# Altium project FPGA_EP4CE10F17C8N.PrjPcb
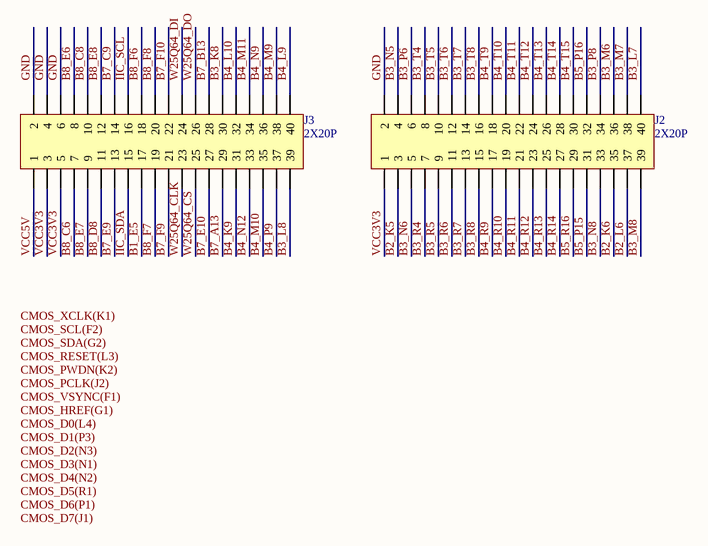
[diagram p0: 1_BTB.SchDoc]
4 sheets, 181 parts. Net scope: global (net labels, ports and power ports of the same name join across sheets).
Board file: EP4CE10F17NC8N.PcbDoc
Sheets:
  1_BTB.SchDoc
  2_FPGAIO.SchDoc
  3_SDRAM.SchDoc
  4_HDMI+ETH.SchDoc

## Sheet 1_BTB.SchDoc
size A4; SheetNumber: 1; SheetTotal: 4

### Parts
J2  2X20P  [HEAD_2X20P]
J3  2X20P  [HEAD_2X20P]

### Nets
GND: J2.2 J3.2 J3.4 J3.6
VCC3V3: J2.1 J3.3 J3.5
VCC5V: J3.1
B1_E5: J3.17
B2_K5: J2.3
B2_K6: J2.35
B2_L6: J2.37
B3_K8: J3.30
B3_L7: J2.40
B3_L8: J3.39
B3_M6: J2.36
B3_M7: J2.38
B3_M8: J2.39
B3_N5: J2.4
B3_N6: J2.5
B3_N8: J2.33
B3_P6: J2.6
B3_P8: J2.34
B3_R4: J2.7
B3_R5: J2.9
B3_R6: J2.11
B3_R7: J2.13
B3_R8: J2.15
B3_T4: J2.8
B3_T5: J2.10
B3_T6: J2.12
B3_T7: J2.14
B3_T8: J2.16
B4_K9: J3.31
B4_L9: J3.40
B4_L10: J3.32
B4_M9: J3.38
B4_M10: J3.35
B4_M11: J3.34
B4_N9: J3.36
B4_N12: J3.33
B4_P9: J3.37
B4_R9: J2.17
B4_R10: J2.19
B4_R11: J2.21
B4_R12: J2.23
B4_R13: J2.25
B4_R14: J2.27
B4_T9: J2.18
B4_T10: J2.20
B4_T11: J2.22
B4_T12: J2.24
B4_T13: J2.26
B4_T14: J2.28
B4_T15: J2.30
B5_P15: J2.31
B5_P16: J2.32
B5_R16: J2.29
B7_A13: J3.29
B7_B13: J3.28
B7_C9: J3.14
B7_E9: J3.13
B7_E10: J3.27
B7_F9: J3.21
B7_F10: J3.22
B8_C6: J3.7
B8_C8: J3.10
B8_D8: J3.11
B8_E6: J3.8
B8_E7: J3.9
B8_E8: J3.12
B8_F6: J3.18
B8_F7: J3.19
B8_F8: J3.20
IIC_SCL: J3.16
IIC_SDA: J3.15
W25Q64_CLK: J3.23
W25Q64_CS: J3.25
W25Q64_DI: J3.24
W25Q64_DO: J3.26

### Notes on the sheet
- Labels drawn without touching a wire or pin: CMOS_D0(L4), CMOS_D1(P3), CMOS_D2(N3), CMOS_D3(N1), CMOS_D4(N2), CMOS_D5(R1), CMOS_D6(P1), CMOS_D7(J1), CMOS_HREF(G1), CMOS_PCLK(J2), CMOS_PWDN(K2), CMOS_RESET(L3), CMOS_SCL(F2), CMOS_SDA(G2), CMOS_VSYNC(F1), CMOS_XCLK(K1)

## Sheet 2_FPGAIO.SchDoc
size A3; SheetNumber: 2; SheetTotal: 4
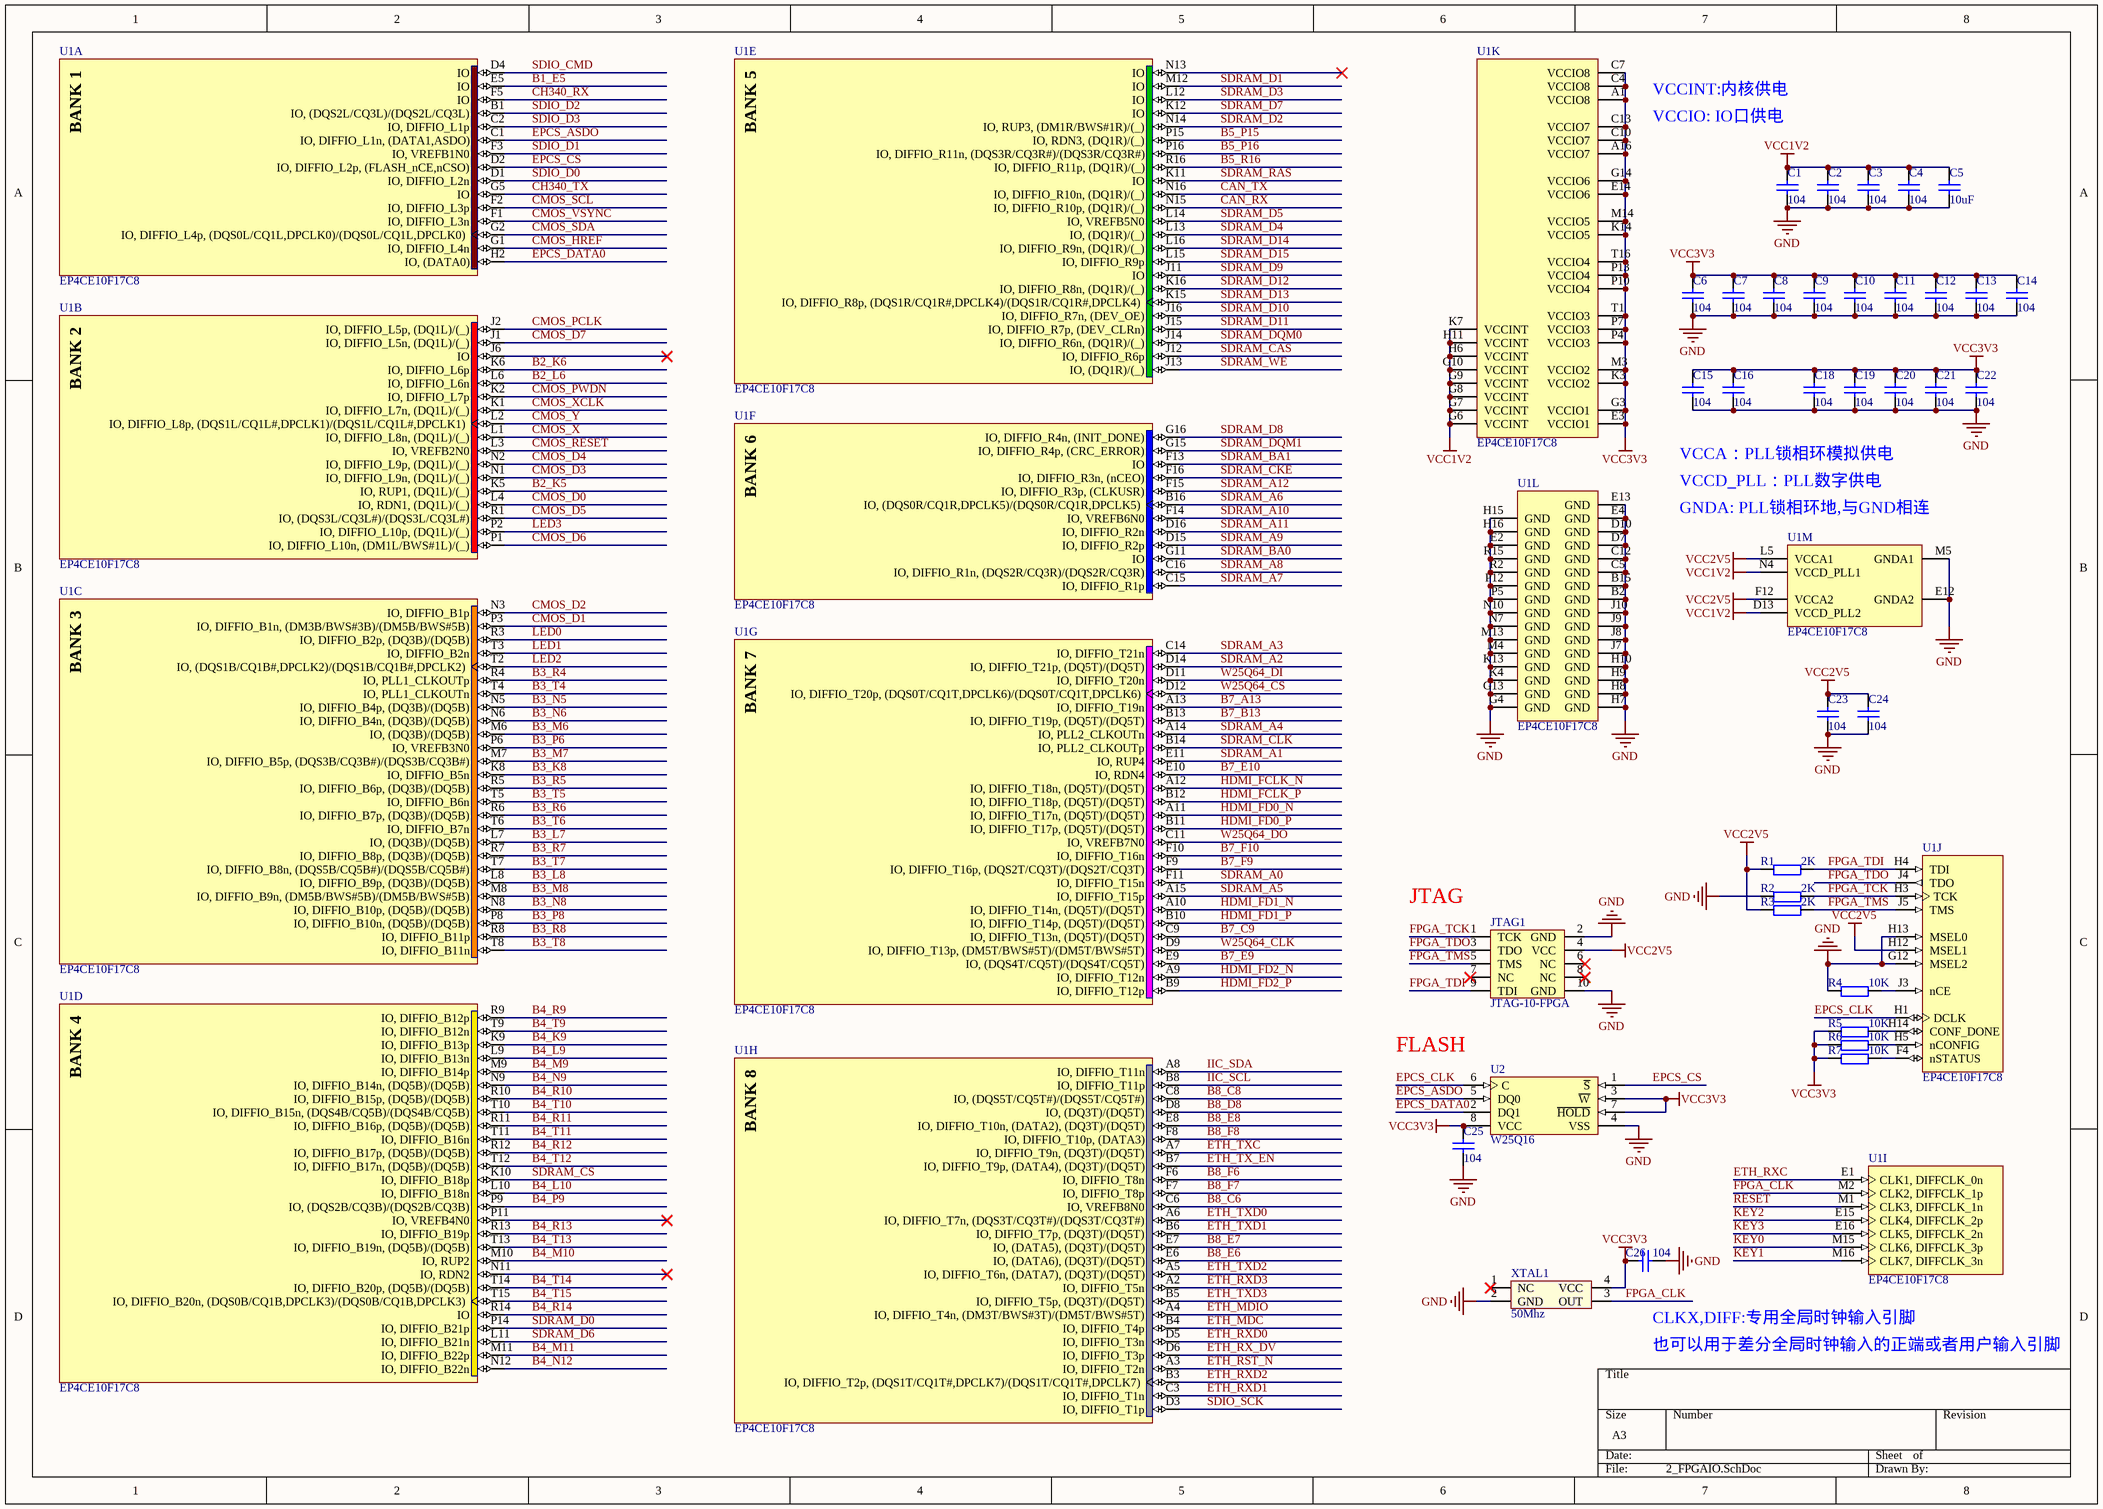
[diagram p1: 2_FPGAIO.SchDoc]

### Parts
C1  104  [C 0402]
C2  104  [C 0402]
C3  104  [C 0402]
C4  104  [C 0402]
C5  10uF  [C 0402]
C6  104  [C 0402]
C7  104  [C 0402]
C8  104  [C 0402]
C9  104  [C 0402]
C10  104  [C 0402]
C11  104  [C 0402]
C12  104  [C 0402]
C13  104  [C 0402]
C14  104  [C 0402]
C15  104  [C 0402]
C16  104  [C 0402]
C18  104  [C 0402]
C19  104  [C 0402]
C20  104  [C 0402]
C21  104  [C 0402]
C22  104  [C 0402]
C23  104  [C 0402]
C24  104  [C 0402]
C25  104  [C 0603]
C26  104  [C 0603]
JTAG1  JTAG-10-FPGA  [JTAG座_弯角_2x5]
R1  2K  [R 0402]
R2  2K  [R 0402]
R3  2K  [R 0402]
R4  10K  [R 0402]
R5  10K  [R 0402]
R6  10K  [R 0402]
R7  10K  [R 0402]
U1  EP4CE10F17C8  [FBGA256]  (parts A,B,C,D,E,F,G,H,I,J,K,L,M of 13)
U2  W25Q16  [SOIC-8_L5.3-W5.3-P1.27-LS8.0-BL]
XTAL1  50Mhz  [XTAL3225]

### Nets
GND: C1.2 C2.2 C3.2 C4.2 C5.2 C6.2 C7.2 C8.2 C9.2 C10.2 C11.2 C12.2 C13.2 C14.2 C15.2 C16.2 C18.2 C19.2 C20.2 C21.2 C22.2 C23.2 C24.2 C25.2 C26.2 JTAG1.2(GND) JTAG1.10(GND) R2.1 R4.1 U1.B2(GND) U1.B15(GND) U1.C5(GND) U1.C12(GND) U1.D7(GND) U1.D10(GND) U1.E2(GND) U1.E4(GND) U1.E12(GNDA2) U1.E13(GND) U1.G4(GND) U1.G12(MSEL2) U1.G13(GND) U1.H7(GND) U1.H8(GND) U1.H9(GND) U1.H10(GND) U1.H13(MSEL0) U1.H15(GND) U1.H16(GND) U1.J7(GND) U1.J8(GND) U1.J9(GND) U1.J10(GND) U1.K4(GND) U1.K13(GND) U1.M4(GND) U1.M5(GNDA1) U1.M13(GND) U1.N7(GND) U1.N10(GND) U1.P5(GND) U1.P12(GND) U1.R2(GND) U1.R15(GND) U2.4(VSS) XTAL1.2(GND)
VCC1V2: C1.1 C2.1 C3.1 C4.1 C5.1 U1.D13(VCCD_PLL2) U1.G6(VCCINT) U1.G7(VCCINT) U1.G8(VCCINT) U1.G9(VCCINT) U1.G10(VCCINT) U1.H6(VCCINT) U1.H11(VCCINT) U1.K7(VCCINT) U1.N4(VCCD_PLL1)
VCC2V5: C23.1 C24.1 JTAG1.4(VCC) R1.1 R3.1 U1.F12(VCCA2) U1.H12(MSEL1) U1.L5(VCCA1)
VCC3V3: C6.1 C7.1 C8.1 C9.1 C10.1 C11.1 C12.1 C13.1 C14.1 C15.1 C16.1 C18.1 C19.1 C20.1 C21.1 C22.1 C25.1 C26.1 R5.1 R6.1 R7.1 U1.A1(VCCIO8) U1.A16(VCCIO7) U1.C4(VCCIO8) U1.C7(VCCIO8) U1.C10(VCCIO7) U1.C13(VCCIO7) U1.E3(VCCIO1) U1.E14(VCCIO6) U1.G3(VCCIO1) U1.G14(VCCIO6) U1.K3(VCCIO2) U1.K14(VCCIO5) U1.M3(VCCIO2) U1.M14(VCCIO5) U1.P4(VCCIO3) U1.P7(VCCIO3) U1.P10(VCCIO4) U1.P13(VCCIO4) U1.T1(VCCIO3) U1.T16(VCCIO4) U2.3(~{W}) U2.7(~{HOLD}) U2.8(VCC) XTAL1.4(VCC)
B1_E5: U1.E5(IO)
B2_K5: U1.K5(IO,_RUP1,_(DQ1L)/(_))
B2_K6: U1.K6(IO,_DIFFIO_L6p)
B2_L6: U1.L6(IO,_DIFFIO_L6n)
B3_K8: U1.K8(IO,_DIFFIO_B5n)
B3_L7: U1.L7(IO,_(DQ3B)/(DQ5B))
B3_L8: U1.L8(IO,_DIFFIO_B9p,_(DQ3B)/(DQ5B))
B3_M6: U1.M6(IO,_(DQ3B)/(DQ5B))
B3_M7: U1.M7(IO,_DIFFIO_B5p,_(DQS3B/CQ3B#)/(DQS3B/CQ3B#))
B3_M8: U1.M8(IO,_DIFFIO_B9n,_(DM5B/BWS#5B)/(DM5B/BWS#5B))
B3_N5: U1.N5(IO,_DIFFIO_B4p,_(DQ3B)/(DQ5B))
B3_N6: U1.N6(IO,_DIFFIO_B4n,_(DQ3B)/(DQ5B))
B3_N8: U1.N8(IO,_DIFFIO_B10p,_(DQ5B)/(DQ5B))
B3_P6: U1.P6(IO,_VREFB3N0)
B3_P8: U1.P8(IO,_DIFFIO_B10n,_(DQ5B)/(DQ5B))
B3_R4: U1.R4(IO,_PLL1_CLKOUTp)
B3_R5: U1.R5(IO,_DIFFIO_B6p,_(DQ3B)/(DQ5B))
B3_R6: U1.R6(IO,_DIFFIO_B7p,_(DQ3B)/(DQ5B))
B3_R7: U1.R7(IO,_DIFFIO_B8p,_(DQ3B)/(DQ5B))
B3_R8: U1.R8(IO,_DIFFIO_B11p)
B3_T4: U1.T4(IO,_PLL1_CLKOUTn)
B3_T5: U1.T5(IO,_DIFFIO_B6n)
B3_T6: U1.T6(IO,_DIFFIO_B7n)
B3_T7: U1.T7(IO,_DIFFIO_B8n,_(DQS5B/CQ5B#)/(DQS5B/CQ5B#))
B3_T8: U1.T8(IO,_DIFFIO_B11n)
B4_K9: U1.K9(IO,_DIFFIO_B13p)
B4_L9: U1.L9(IO,_DIFFIO_B13n)
B4_L10: U1.L10(IO,_DIFFIO_B18n)
B4_M9: U1.M9(IO,_DIFFIO_B14p)
B4_M10: U1.M10(IO,_RUP2)
B4_M11: U1.M11(IO,_DIFFIO_B22p)
B4_N9: U1.N9(IO,_DIFFIO_B14n,_(DQ5B)/(DQ5B))
B4_N12: U1.N12(IO,_DIFFIO_B22n)
B4_P9: U1.P9(IO,_(DQS2B/CQ3B)/(DQS2B/CQ3B))
B4_R9: U1.R9(IO,_DIFFIO_B12p)
B4_R10: U1.R10(IO,_DIFFIO_B15p,_(DQ5B)/(DQ5B))
B4_R11: U1.R11(IO,_DIFFIO_B16p,_(DQ5B)/(DQ5B))
B4_R12: U1.R12(IO,_DIFFIO_B17p,_(DQ5B)/(DQ5B))
B4_R13: U1.R13(IO,_DIFFIO_B19p)
B4_R14: U1.R14(IO)
B4_T9: U1.T9(IO,_DIFFIO_B12n)
B4_T10: U1.T10(IO,_DIFFIO_B15n,_(DQS4B/CQ5B)/(DQS4B/CQ5B))
B4_T11: U1.T11(IO,_DIFFIO_B16n)
B4_T12: U1.T12(IO,_DIFFIO_B17n,_(DQ5B)/(DQ5B))
B4_T13: U1.T13(IO,_DIFFIO_B19n,_(DQ5B)/(DQ5B))
B4_T14: U1.T14(IO,_DIFFIO_B20p,_(DQ5B)/(DQ5B))
B4_T15: U1.T15(IO,_DIFFIO_B20n,_(DQS0B/CQ1B,DPCLK3)/(DQS0B/CQ1B,DPCLK3))
B5_P15: U1.P15(IO,_RDN3,_(DQ1R)/(_))
B5_P16: U1.P16(IO,_DIFFIO_R11n,_(DQS3R/CQ3R#)/(DQS3R/CQ3R#))
B5_R16: U1.R16(IO,_DIFFIO_R11p,_(DQ1R)/(_))
B7_A13: U1.A13(IO,_DIFFIO_T19n)
B7_B13: U1.B13(IO,_DIFFIO_T19p,_(DQ5T)/(DQ5T))
B7_C9: U1.C9(IO,_DIFFIO_T13n,_(DQ5T)/(DQ5T))
B7_E9: U1.E9(IO,_(DQS4T/CQ5T)/(DQS4T/CQ5T))
B7_E10: U1.E10(IO,_RDN4)
B7_F9: U1.F9(IO,_DIFFIO_T16p,_(DQS2T/CQ3T)/(DQS2T/CQ3T))
B7_F10: U1.F10(IO,_DIFFIO_T16n)
B8_C6: U1.C6(IO,_VREFB8N0)
B8_C8: U1.C8(IO,_(DQS5T/CQ5T#)/(DQS5T/CQ5T#))
B8_D8: U1.D8(IO,_(DQ3T)/(DQ5T))
B8_E6: U1.E6(IO,_(DATA6),_(DQ3T)/(DQ5T))
B8_E7: U1.E7(IO,_(DATA5),_(DQ3T)/(DQ5T))
B8_E8: U1.E8(IO,_DIFFIO_T10n,_(DATA2),_(DQ3T)/(DQ5T))
B8_F6: U1.F6(IO,_DIFFIO_T8n)
B8_F7: U1.F7(IO,_DIFFIO_T8p)
B8_F8: U1.F8(IO,_DIFFIO_T10p,_(DATA3))
CAN_RX: U1.N15(IO,_DIFFIO_R10p,_(DQ1R)/(_))
CAN_TX: U1.N16(IO,_DIFFIO_R10n,_(DQ1R)/(_))
CH340_RX: U1.F5(IO)
CH340_TX: U1.G5(IO)
CMOS_D0: U1.L4(IO,_RDN1,_(DQ1L)/(_))
CMOS_D1: U1.P3(IO,_DIFFIO_B1n,_(DM3B/BWS#3B)/(DM5B/BWS#5B))
CMOS_D2: U1.N3(IO,_DIFFIO_B1p)
CMOS_D3: U1.N1(IO,_DIFFIO_L9n,_(DQ1L)/(_))
CMOS_D4: U1.N2(IO,_DIFFIO_L9p,_(DQ1L)/(_))
CMOS_D5: U1.R1(IO,_(DQS3L/CQ3L#)/(DQS3L/CQ3L#))
CMOS_D6: U1.P1(IO,_DIFFIO_L10n,_(DM1L/BWS#1L)/(_))
CMOS_D7: U1.J1(IO,_DIFFIO_L5n,_(DQ1L)/(_))
CMOS_HREF: U1.G1(IO,_DIFFIO_L4n)
CMOS_PCLK: U1.J2(IO,_DIFFIO_L5p,_(DQ1L)/(_))
CMOS_PWDN: U1.K2(IO,_DIFFIO_L7p)
CMOS_RESET: U1.L3(IO,_VREFB2N0)
CMOS_SCL: U1.F2(IO,_DIFFIO_L3p)
CMOS_SDA: U1.G2(IO,_DIFFIO_L4p,_(DQS0L/CQ1L,DPCLK0)/(DQS0L/CQ1L,DPCLK0))
CMOS_VSYNC: U1.F1(IO,_DIFFIO_L3n)
CMOS_X: U1.L1(IO,_DIFFIO_L8n,_(DQ1L)/(_))
CMOS_XCLK: U1.K1(IO,_DIFFIO_L7n,_(DQ1L)/(_))
CMOS_Y: U1.L2(IO,_DIFFIO_L8p,_(DQS1L/CQ1L#,DPCLK1)/(DQS1L/CQ1L#,DPCLK1))
EPCS_ASDO: U1.C1(IO,_DIFFIO_L1n,_(DATA1,ASDO)) U2.5(DQ0)
EPCS_CLK: U1.H1(DCLK) U2.6(C)
EPCS_CS: U1.D2(IO,_DIFFIO_L2p,_(FLASH_nCE,nCSO)) U2.1(~{S})
EPCS_DATA0: U1.H2(IO,_(DATA0)) U2.2(DQ1)
ETH_MDC: U1.B4(IO,_DIFFIO_T4p)
ETH_MDIO: U1.A4(IO,_DIFFIO_T4n,_(DM3T/BWS#3T)/(DM5T/BWS#5T))
ETH_RST_N: U1.A3(IO,_DIFFIO_T2n)
ETH_RX_DV: U1.D6(IO,_DIFFIO_T3p)
ETH_RXC: U1.E1(CLK1,_DIFFCLK_0n)
ETH_RXD0: U1.D5(IO,_DIFFIO_T3n)
ETH_RXD1: U1.C3(IO,_DIFFIO_T1n)
ETH_RXD2: U1.B3(IO,_DIFFIO_T2p,_(DQS1T/CQ1T#,DPCLK7)/(DQS1T/CQ1T#,DPCLK7))
ETH_RXD3: U1.A2(IO,_DIFFIO_T5n)
ETH_TX_EN: U1.B7(IO,_DIFFIO_T9p,_(DATA4),_(DQ3T)/(DQ5T))
ETH_TXC: U1.A7(IO,_DIFFIO_T9n,_(DQ3T)/(DQ5T))
ETH_TXD0: U1.A6(IO,_DIFFIO_T7n,_(DQS3T/CQ3T#)/(DQS3T/CQ3T#))
ETH_TXD1: U1.B6(IO,_DIFFIO_T7p,_(DQ3T)/(DQ5T))
ETH_TXD2: U1.A5(IO,_DIFFIO_T6n,_(DATA7),_(DQ3T)/(DQ5T))
ETH_TXD3: U1.B5(IO,_DIFFIO_T5p,_(DQ3T)/(DQ5T))
FPGA_CLK: U1.M2(CLK2,_DIFFCLK_1p) XTAL1.3(OUT)
FPGA_TCK: JTAG1.1(TCK) R2.2 U1.H3(TCK)
FPGA_TDI: JTAG1.9(TDI) R1.2 U1.H4(TDI)
FPGA_TDO: JTAG1.3(TDO) U1.J4(TDO)
FPGA_TMS: JTAG1.5(TMS) R3.2 U1.J5(TMS)
HDMI_FCLK_N: U1.A12(IO,_DIFFIO_T18n,_(DQ5T)/(DQ5T))
HDMI_FCLK_P: U1.B12(IO,_DIFFIO_T18p,_(DQ5T)/(DQ5T))
HDMI_FD0_N: U1.A11(IO,_DIFFIO_T17n,_(DQ5T)/(DQ5T))
HDMI_FD0_P: U1.B11(IO,_DIFFIO_T17p,_(DQ5T)/(DQ5T))
HDMI_FD1_N: U1.A10(IO,_DIFFIO_T14n,_(DQ5T)/(DQ5T))
HDMI_FD1_P: U1.B10(IO,_DIFFIO_T14p,_(DQ5T)/(DQ5T))
HDMI_FD2_N: U1.A9(IO,_DIFFIO_T12n)
HDMI_FD2_P: U1.B9(IO,_DIFFIO_T12p)
IIC_SCL: U1.B8(IO,_DIFFIO_T11p)
IIC_SDA: U1.A8(IO,_DIFFIO_T11n)
KEY0: U1.M15(CLK6,_DIFFCLK_3p)
KEY1: U1.M16(CLK7,_DIFFCLK_3n)
KEY2: U1.E15(CLK4,_DIFFCLK_2p)
KEY3: U1.E16(CLK5,_DIFFCLK_2n)
LED0: U1.R3(IO,_DIFFIO_B2p,_(DQ3B)/(DQ5B))
LED1: U1.T3(IO,_DIFFIO_B2n)
LED2: U1.T2(IO,_(DQS1B/CQ1B#,DPCLK2)/(DQS1B/CQ1B#,DPCLK2))
LED3: U1.P2(IO,_DIFFIO_L10p,_(DQ1L)/(_))
RESET: U1.M1(CLK3,_DIFFCLK_1n)
SDIO_CMD: U1.D4(IO)
SDIO_D0: U1.D1(IO,_DIFFIO_L2n)
SDIO_D1: U1.F3(IO,_VREFB1N0)
SDIO_D2: U1.B1(IO,_(DQS2L/CQ3L)/(DQS2L/CQ3L))
SDIO_D3: U1.C2(IO,_DIFFIO_L1p)
SDIO_SCK: U1.D3(IO,_DIFFIO_T1p)
SDRAM_A0: U1.F11(IO,_DIFFIO_T15n)
SDRAM_A1: U1.E11(IO,_RUP4)
SDRAM_A2: U1.D14(IO,_DIFFIO_T21p,_(DQ5T)/(DQ5T))
SDRAM_A3: U1.C14(IO,_DIFFIO_T21n)
SDRAM_A4: U1.A14(IO,_PLL2_CLKOUTn)
SDRAM_A5: U1.A15(IO,_DIFFIO_T15p)
SDRAM_A6: U1.B16(IO,_(DQS0R/CQ1R,DPCLK5)/(DQS0R/CQ1R,DPCLK5))
SDRAM_A7: U1.C15(IO,_DIFFIO_R1p)
SDRAM_A8: U1.C16(IO,_DIFFIO_R1n,_(DQS2R/CQ3R)/(DQS2R/CQ3R))
SDRAM_A9: U1.D15(IO,_DIFFIO_R2p)
SDRAM_A10: U1.F14(IO,_VREFB6N0)
SDRAM_A11: U1.D16(IO,_DIFFIO_R2n)
SDRAM_A12: U1.F15(IO,_DIFFIO_R3p,_(CLKUSR))
SDRAM_BA0: U1.G11(IO)
SDRAM_BA1: U1.F13(IO)
SDRAM_CAS: U1.J12(IO,_DIFFIO_R6p)
SDRAM_CKE: U1.F16(IO,_DIFFIO_R3n,_(nCEO))
SDRAM_CLK: U1.B14(IO,_PLL2_CLKOUTp)
SDRAM_CS: U1.K10(IO,_DIFFIO_B18p)
SDRAM_D0: U1.P14(IO,_DIFFIO_B21p)
SDRAM_D1: U1.M12(IO)
SDRAM_D2: U1.N14(IO,_RUP3,_(DM1R/BWS#1R)/(_))
SDRAM_D3: U1.L12(IO)
SDRAM_D4: U1.L13(IO,_(DQ1R)/(_))
SDRAM_D5: U1.L14(IO,_VREFB5N0)
SDRAM_D6: U1.L11(IO,_DIFFIO_B21n)
SDRAM_D7: U1.K12(IO)
SDRAM_D8: U1.G16(IO,_DIFFIO_R4n,_(INIT_DONE))
SDRAM_D9: U1.J11(IO)
SDRAM_D10: U1.J16(IO,_DIFFIO_R7n,_(DEV_OE))
SDRAM_D11: U1.J15(IO,_DIFFIO_R7p,_(DEV_CLRn))
SDRAM_D12: U1.K16(IO,_DIFFIO_R8n,_(DQ1R)/(_))
SDRAM_D13: U1.K15(IO,_DIFFIO_R8p,_(DQS1R/CQ1R#,DPCLK4)/(DQS1R/CQ1R#,DPCLK4))
SDRAM_D14: U1.L16(IO,_DIFFIO_R9n,_(DQ1R)/(_))
SDRAM_D15: U1.L15(IO,_DIFFIO_R9p)
SDRAM_DQM0: U1.J14(IO,_DIFFIO_R6n,_(DQ1R)/(_))
SDRAM_DQM1: U1.G15(IO,_DIFFIO_R4p,_(CRC_ERROR))
SDRAM_RAS: U1.K11(IO)
SDRAM_WE: U1.J13(IO,_(DQ1R)/(_))
W25Q64_CLK: U1.D9(IO,_DIFFIO_T13p,_(DM5T/BWS#5T)/(DM5T/BWS#5T))
W25Q64_CS: U1.D12(IO,_DIFFIO_T20p,_(DQS0T/CQ1T,DPCLK6)/(DQS0T/CQ1T,DPCLK6))
W25Q64_DI: U1.D11(IO,_DIFFIO_T20n)
W25Q64_DO: U1.C11(IO,_VREFB7N0)
NetR4_2: R4.2 U1.J3(nCE)
NetR5_2: R5.2 U1.H14(CONF_DONE)
NetR6_2: R6.2 U1.H5(nCONFIG)
NetR7_2: R7.2 U1.F4(nSTATUS)

Not connected (* = marked no-connect by the designer): JTAG1 6(NC)* 7(NC)* 8(NC)*; U1 J6(IO)* N11(IO,_RDN2)* N13(IO)* P11(IO,_VREFB4N0)*; XTAL1 1(NC)*

### Notes on the sheet
- VCCINT:内核供电
- VCCIO: IO口供电
- (near U1) GNDA: PLL锁相环地,与GND相连
- VCCA：PLL锁相环模拟供电
- VCCD_PLL：PLL数字供电
- (near JTAG1) JTAG
- FLASH
- CLKX,DIFF:专用全局时钟输入引脚
- 也可以用于差分全局时钟输入的正端或者用户输入引脚
- (in symbol EP4CE6F17C8, part A) BANK 1
- (in symbol EP4CE6F17C8, part B) BANK 2
- (in symbol EP4CE6F17C8, part C) BANK 3
- (in symbol EP4CE6F17C8, part D) BANK 4
- (in symbol EP4CE6F17C8, part E) BANK 5
- (in symbol EP4CE6F17C8, part F) BANK 6
- (in symbol EP4CE6F17C8, part G) BANK 7
- (in symbol EP4CE6F17C8, part H) BANK 8

### Library data of the parts
C1-C16 C18-C26 = C-0603-SMD
R1-R7 = R
U1 = EP4CE6F17C8: Cyclone IV Family FPGA, 2V Core, 179 I/O Pins, 2 PLLs, 256-Pin FBGA, Speed Grade 8, Commercial Grade; Published: 3-May-2010; DatasheetVersion: ver1.2, Mar-2010; PackageVersion: ver16.0, Dec-2009; PackageReference: FBGA256; Publisher: Altium Limited; PackageDescription: 256-Ball FineLine Ball Grid Array (FBGA256) - Option 1 - Wire Bond; Supplier 1: Digi-Key; Supplier Part Number 1: EP4CE6F17C8-ND; Code_JEDEC: MS-034-AAF-1; Code_IPC: BGA100P16X16-256; ComponentLink1Description: Manufacturer Link; ComponentLink1URL: http://www.altera.com/; ComponentLink2Description: Handbook; ComponentLink2URL: http://www.altera.com/literature/hb/cyclone-iv/cyclone4-handbook.pdf; ComponentLink3Description: Pinout Specification; ComponentLink3URL: http://www.altera.com/literature/lit-dp.jsp?category=cyc%204&showspreadsheet=y; ComponentLink4Description: Packaging Specification; ComponentLink4URL: http://www.altera.com/literature/ds/dspkg.pdf
U2 = M25P16: 16 Mb (x1) Automotive Serial NOR Flash Memory, 75 MHz, 2.7 to 3.6 V, 8-pin SO8; Part Family: M25P爭ISHIDDEN=T|; Manufacturer: Micron; PartNumber: M25P16-VMN3PB; Density: 16Mb爭ISHIDDEN=T|; Speed: 75 MHz爭ISHIDDEN=T|; Voltage: 2.7V-3.6V爭ISHIDDEN=T|; DatasheetVersion: Rev. Y; PackageVersion: Rev 11; PackageReference: MICT-MN-8; PackageDescription: 8-Pin SO Narrow, 3.9 X 4.9 mm, Pitch 1.27 mm; Applications: Automotive爭ISHIDDEN=T|; Package: SO8 Narrow爭ISHIDDEN=T|; Part Status: Production爭ISHIDDEN=T|; RoHS: Yes爭ISHIDDEN=T|; Type: Data Storage爭ISHIDDEN=T|; Width: x1爭ISHIDDEN=T|; Mounting Technology: Surface Mount; ComponentLink1Description: Manufacturer URL; ComponentLink1URL: http://www.micron.com/; ComponentLink2Description: Datasheet; ComponentLink2URL: http://www.micron.com/~/media/Documents/Products/Data%20Sheet/NOR%20Flash/Serial%20NOR/M25P/M25P16.pdf; ComponentLink3Description: Package Specification; ComponentLink3URL: http://www.micron.com/~/media/Documents/Products/Data%20Sheet/NOR%20Flash/Serial%20NOR/M25P/M25P05A.pdf
XTAL1 = XTAL_S: 有源晶振

## Sheet 3_SDRAM.SchDoc
size A4; SheetNumber: 3; SheetTotal: 4
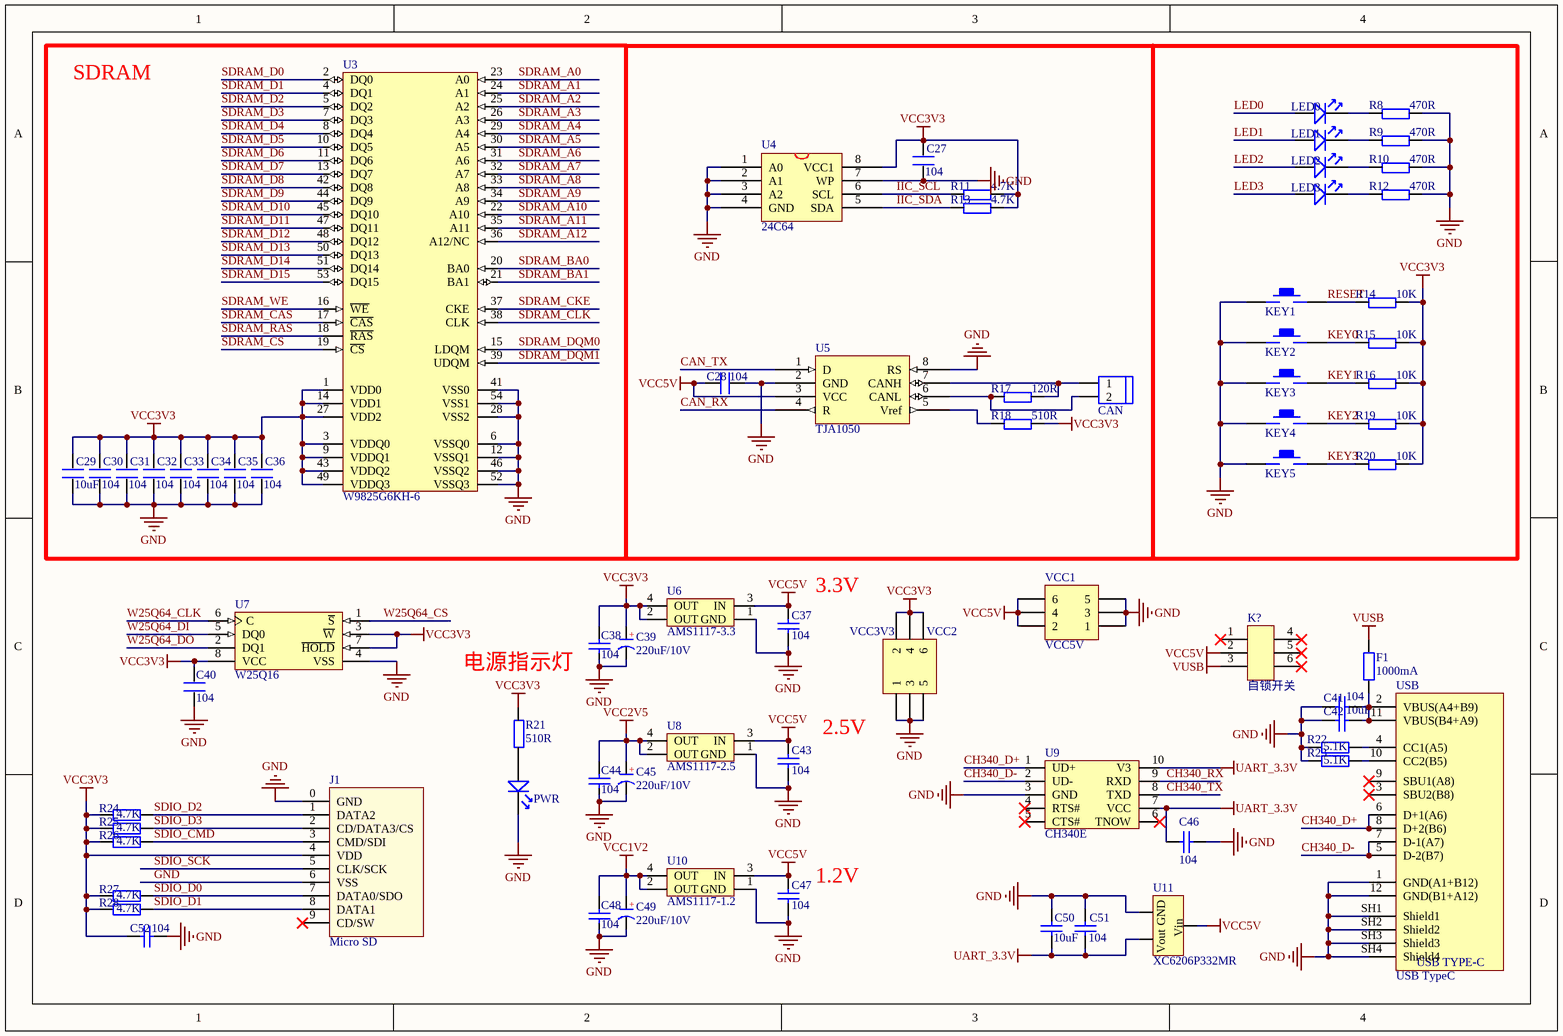
[diagram p2: 3_SDRAM.SchDoc]

### Parts
C27  104  [C 0603]
C28  104  [C 0603]
C29  10uF  [C 0402]
C30  104  [C 0402]
C31  104  [C 0402]
C32  104  [C 0402]
C33  104  [C 0402]
C34  104  [C 0402]
C35  104  [C 0402]
C36  104  [C 0402]
C37  104  [C 0603]
C38  104  [C 0603]
C39  220uF/10V  [CD 6.3*5.4 S]
C40  104  [C 0603]
C41  104  [C 0603]
C42  10uF  [C 0603]
C43  104  [C 0603]
C44  104  [C 0603]
C45  220uF/10V  [CD 6.3*5.4 S]
C46  104  [C 0603]
C47  104  [C 0603]
C48  104  [C 0603]
C49  220uF/10V  [CD 6.3*5.4 S]
C50  10uF  [C 0603]
C51  104  [C 0603]
C52  104  [C 0603]
CAN?  CAN  [HEAD2L-0.8]
F1  1000mA  [R 0603]
J1  Micro SD  [SD-MICRO-TF]
K?  自锁开关  [自锁开关]
KEY1  KEY_M  [KEY 3.2*4.2*2.5 4P SMD - SCH 2pin]  (value not drawn)
KEY2  KEY_M  [KEY 3.2*4.2*2.5 4P SMD - SCH 2pin]  (value not drawn)
KEY3  KEY_M  [KEY 3.2*4.2*2.5 4P SMD - SCH 2pin]  (value not drawn)
KEY4  KEY_M  [KEY 3.2*4.2*2.5 4P SMD - SCH 2pin]  (value not drawn)
KEY5  KEY_M  [KEY 3.2*4.2*2.5 4P SMD - SCH 2pin]  (value not drawn)
LED1  LED0  [LED 0603 Red]
LED2  LED1  [LED 0603 Red]
LED3  LED2  [LED 0603 Red]
LED4  LED3  [LED 0603 Red]
LED5  PWR  [LED 0603 Red]
R8  470R  [R 0603]
R9  470R  [R 0603]
R10  470R  [R 0603]
R11  4.7K  [R 0603]
R12  470R  [R 0603]
R13  4.7K  [R 0603]
R14  10K  [R 0603]
R15  10K  [R 0603]
R16  10K  [R 0603]
R17  120R  [R 0603]
R18  510R  [R 0603]
R19  10K  [R 0603]
R20  10K  [R 0603]
R21  510R  [R 0603]
R22  5.1K  [R 0603]
R23  5.1K  [R 0603]
R24  4.7K  [R 0603]
R25  4.7K  [R 0603]
R26  4.7K  [R 0603]
R27  4.7K  [R 0603]
R28  4.7K  [R 0603]
U3  W9825G6KH-6  [TSOP54]
U4  24C64  [SOP-8]
U5  TJA1050  [SOP-8]
U6  AMS1117-3.3  [AMS1117]
U7  W25Q16  [SOIC-8_L5.3-W5.3-P1.27-LS8.0-BL]
U8  AMS1117-2.5  [AMS1117]
U9  CH340E  [MSOP10_L]
U10  AMS1117-1.2  [AMS1117]
U11  XC6206P332MR  [SOT23-3N]
USB  USB TypeC  [USB2.0-TYPE-C-16P]
VCC1  VCC5V  [HDR2X3]
VCC2  VCC3V3  [HDR2X3]

### Blocks framed on the sheet
SDRAM: C29-C36 U3

### Nets
GND: C27.1 C28.1 C29.1 C30.1 C31.1 C32.1 C33.1 C34.1 C35.1 C36.1 C37.2 C38.2 C39.2(K) C40.2 C41.2 C42.2 C43.2 C44.2 C45.2(K) C46.1 C47.2 C48.2 C49.2(K) C50.1 C51.1 C52.2 J1.0(GND) J1.6(VSS) KEY1.1 KEY2.1 KEY3.1 KEY4.1 KEY5.1 LED5.2 R8.2 R9.2 R10.2 R12.2 R22.2 R23.2 U3.6(VSSQ0) U3.12(VSSQ1) U3.28(VSS2) U3.41(VSS0) U3.46(VSSQ2) U3.52(VSSQ3) U3.54(VSS1) U4.1(A0) U4.2(A1) U4.3(A2) U4.4(GND) U4.7(WP) U5.2(GND) U5.8(RS) U6.1(GND) U7.4(VSS) U8.1(GND) U9.3(GND) U10.1(GND) U11.1(GND) USB.1(GND(A1+B12)) USB.12(GND(B1+A12)) USB.SH1(Shield1) USB.SH2(Shield2) USB.SH3(Shield3) USB.SH4(Shield4) VCC1.1 VCC1.3 VCC1.5 VCC2.1 VCC2.3 VCC2.5
UART_3.3V: C46.2 C50.2 C51.2 U9.7(VCC) U9.10(V3) U11.2(Vout)
VCC1V2: C48.1 C49.1(A) U10.2(OUT) U10.4(OUT)
VCC2V5: C44.1 C45.1(A) U8.2(OUT) U8.4(OUT)
VCC3V3: C27.2 C29.2 C30.2 C31.2 C32.2 C33.2 C34.2 C35.2 C36.2 C38.1 C39.1(A) C40.1 C52.1 J1.4(VDD) R11.2 R13.2 R14.2 R15.2 R16.2 R18.2 R19.2 R20.2 R21.2 R24.2 R25.2 R26.2 R27.2 R28.2 U3.1(VDD0) U3.3(VDDQ0) U3.9(VDDQ1) U3.14(VDD1) U3.27(VDD2) U3.43(VDDQ2) U3.49(VDDQ3) U4.8(VCC1) U6.2(OUT) U6.4(OUT) U7.3(~{W}) U7.7(~{HOLD}) U7.8(VCC) VCC2.2 VCC2.4 VCC2.6
VCC5V: C28.2 C37.1 C43.1 C47.1 K?.2 U5.3(VCC) U6.3(IN) U8.3(IN) U10.3(IN) U11.3(Vin) VCC1.2 VCC1.4 VCC1.6
VUSB: F1.2 K?.3
CAN_RX: U5.4(R)
CAN_TX: U5.1(D)
CH340_D+: U9.1(UD+) USB.6(D+1(A6)) USB.8(D+2(B6))
CH340_D-: U9.2(UD-) USB.5(D-2(B7)) USB.7(D-1(A7))
CH340_RX: U9.9(RXD)
CH340_TX: U9.8(TXD)
IIC_SCL: R11.1 U4.6(SCL)
IIC_SDA: R13.1 U4.5(SDA)
KEY0: KEY2.2 R15.1
KEY1: KEY3.2 R16.1
KEY2: KEY4.2 R19.1
KEY3: KEY5.2 R20.1
LED0: LED1.1
LED1: LED2.1
LED2: LED3.1
LED3: LED4.1
RESET: KEY1.2 R14.1
SDIO_CMD: J1.3(CMD/SDI) R26.1
SDIO_D0: J1.7(DATA0/SDO) R27.1
SDIO_D1: J1.8(DATA1) R28.1
SDIO_D2: J1.1(DATA2) R24.1
SDIO_D3: J1.2(CD/DATA3/CS) R25.1
SDIO_SCK: J1.5(CLK/SCK)
SDRAM_A0: U3.23(A0)
SDRAM_A1: U3.24(A1)
SDRAM_A2: U3.25(A2)
SDRAM_A3: U3.26(A3)
SDRAM_A4: U3.29(A4)
SDRAM_A5: U3.30(A5)
SDRAM_A6: U3.31(A6)
SDRAM_A7: U3.32(A7)
SDRAM_A8: U3.33(A8)
SDRAM_A9: U3.34(A9)
SDRAM_A10: U3.22(A10)
SDRAM_A11: U3.35(A11)
SDRAM_A12: U3.36(A12/NC)
SDRAM_BA0: U3.20(BA0)
SDRAM_BA1: U3.21(BA1)
SDRAM_CAS: U3.17(~{CAS})
SDRAM_CKE: U3.37(CKE)
SDRAM_CLK: U3.38(CLK)
SDRAM_CS: U3.19(~{CS})
SDRAM_D0: U3.2(DQ0)
SDRAM_D1: U3.4(DQ1)
SDRAM_D2: U3.5(DQ2)
SDRAM_D3: U3.7(DQ3)
SDRAM_D4: U3.8(DQ4)
SDRAM_D5: U3.10(DQ5)
SDRAM_D6: U3.11(DQ6)
SDRAM_D7: U3.13(DQ7)
SDRAM_D8: U3.42(DQ8)
SDRAM_D9: U3.44(DQ9)
SDRAM_D10: U3.45(DQ10)
SDRAM_D11: U3.47(DQ11)
SDRAM_D12: U3.48(DQ12)
SDRAM_D13: U3.50(DQ13)
SDRAM_D14: U3.51(DQ14)
SDRAM_D15: U3.53(DQ15)
SDRAM_DQM0: U3.15(LDQM)
SDRAM_DQM1: U3.39(UDQM)
SDRAM_RAS: U3.18(~{RAS})
SDRAM_WE: U3.16(~{WE})
W25Q64_CLK: U7.6(C)
W25Q64_CS: U7.1(~{S})
W25Q64_DI: U7.5(DQ0)
W25Q64_DO: U7.2(DQ1)
NetC41_1: C41.1 C42.1 F1.1 USB.2(VBUS(A4+B9)) USB.11(VBUS(B4+A9))
NetCAN?_1: CAN?.1 R17.2 U5.7(CANH)
NetCAN?_2: CAN?.2 R17.1 U5.6(CANL)
NetLED1_2: LED1.2 R8.1
NetLED2_2: LED2.2 R9.1
NetLED3_2: LED3.2 R10.1
NetLED4_2: LED4.2 R12.1
NetLED5_1: LED5.1 R21.1
NetR18_1: R18.1 U5.5(Vref)
NetR22_1: R22.1 USB.4(CC1(A5))
NetR23_1: R23.1 USB.10(CC2(B5))

Not connected (* = marked no-connect by the designer): J1 9(CD/SW)*; K? 1* 4* 5* 6*; U9 4(RTS#)* 5(CTS#)* 6(TNOW)*; USB 3(SBU2(B8))* 9(SBU1(A8))*

### Notes on the sheet
- (near C37) 3.3V
- (near R21) 电源指示灯
- 2.5V
- (near C47) 1.2V
- (in symbol C-CAP) +
- (in symbol USB Type-C) USB TYPE-C

### Library data of the parts
C27-C36 C40 = C
C37 C38 C41-C44 C46-C48 C50-C52 = C-0603-SMD
C39 C45 C49 = C-CAP: 有极性电容; 版权归属: 正点原子; 学习资源: www.openedv.com; BOM名称: 有极性电容
CAN? = HEAD2
F1 R22-R28 = R: 电阻; BOM名称: 贴片电阻; 版权归属: 正点原子; 学习资源: www.openedv.com; Parameter: 电阻
J1 = Micro SD: Micro SD卡; 版权归属: 源创客; BOM名称: Micro SD卡; 学习资源: www.ooocke.com
LED1-LED5 = LED
R8-R21 = R
U3 = IS42S16160B: 32MB SDRAM
U4 = 24C256
U5 = SN65HVD230D
U6 U8 U10 = AMS1117
U7 = M25P16: as U2 on sheet 2_FPGAIO; DatasheetVersion: Rev. Y; PackageVersion: Rev 11; PackageReference: MICT-MN-8; PackageDescription: 8-Pin SO Narrow, 3.9 X 4.9 mm, Pitch 1.27 mm; Applications: Automotive爭ISHIDDEN=T|; Package: SO8 Narrow爭ISHIDDEN=T|; Part Status: Production爭ISHIDDEN=T|; RoHS: Yes爭ISHIDDEN=T|; Type: Data Storage爭ISHIDDEN=T|; Width: x1爭ISHIDDEN=T|; Mounting Technology: Surface Mount; ComponentLink1Description: Manufacturer URL; ComponentLink1URL: http://www.micron.com/; ComponentLink2Description: Datasheet; ComponentLink2URL: http://www.micron.com/~/media/Documents/Products/Data%20Sheet/NOR%20Flash/Serial%20NOR/M25P/M25P16.pdf; ComponentLink3Description: Package Specification; ComponentLink3URL: http://www.micron.com/~/media/Documents/Products/Data%20Sheet/NOR%20Flash/Serial%20NOR/M25P/M25P05A.pdf
U9 = CH340E: USB转串口; BOM名称: 串口转USB; 版权归属: 正点原子; Parameter: 芯片; 学习资源: www.openedv.com
U11 = LDO XC6206: LDO; ComponentLink1Description: 供应商链接; ComponentLink1URL: http://www.szlcsc.com/product/details_5896.html; Package: SOT-23; Supplier: LC; SuppliersPartNumber: C5446
USB = USB Type-C: 12P TypeC 母座
VCC1 VCC2 = Header 3X2: Header, 3-Pin, Dual row; LatestRevisionDate: 17-Jul-2002; LatestRevisionNote: Re-released for DXP Platform.; Publisher: Altium Limited

## Sheet 4_HDMI+ETH.SchDoc
size A4; SheetNumber: 4; SheetTotal: 4
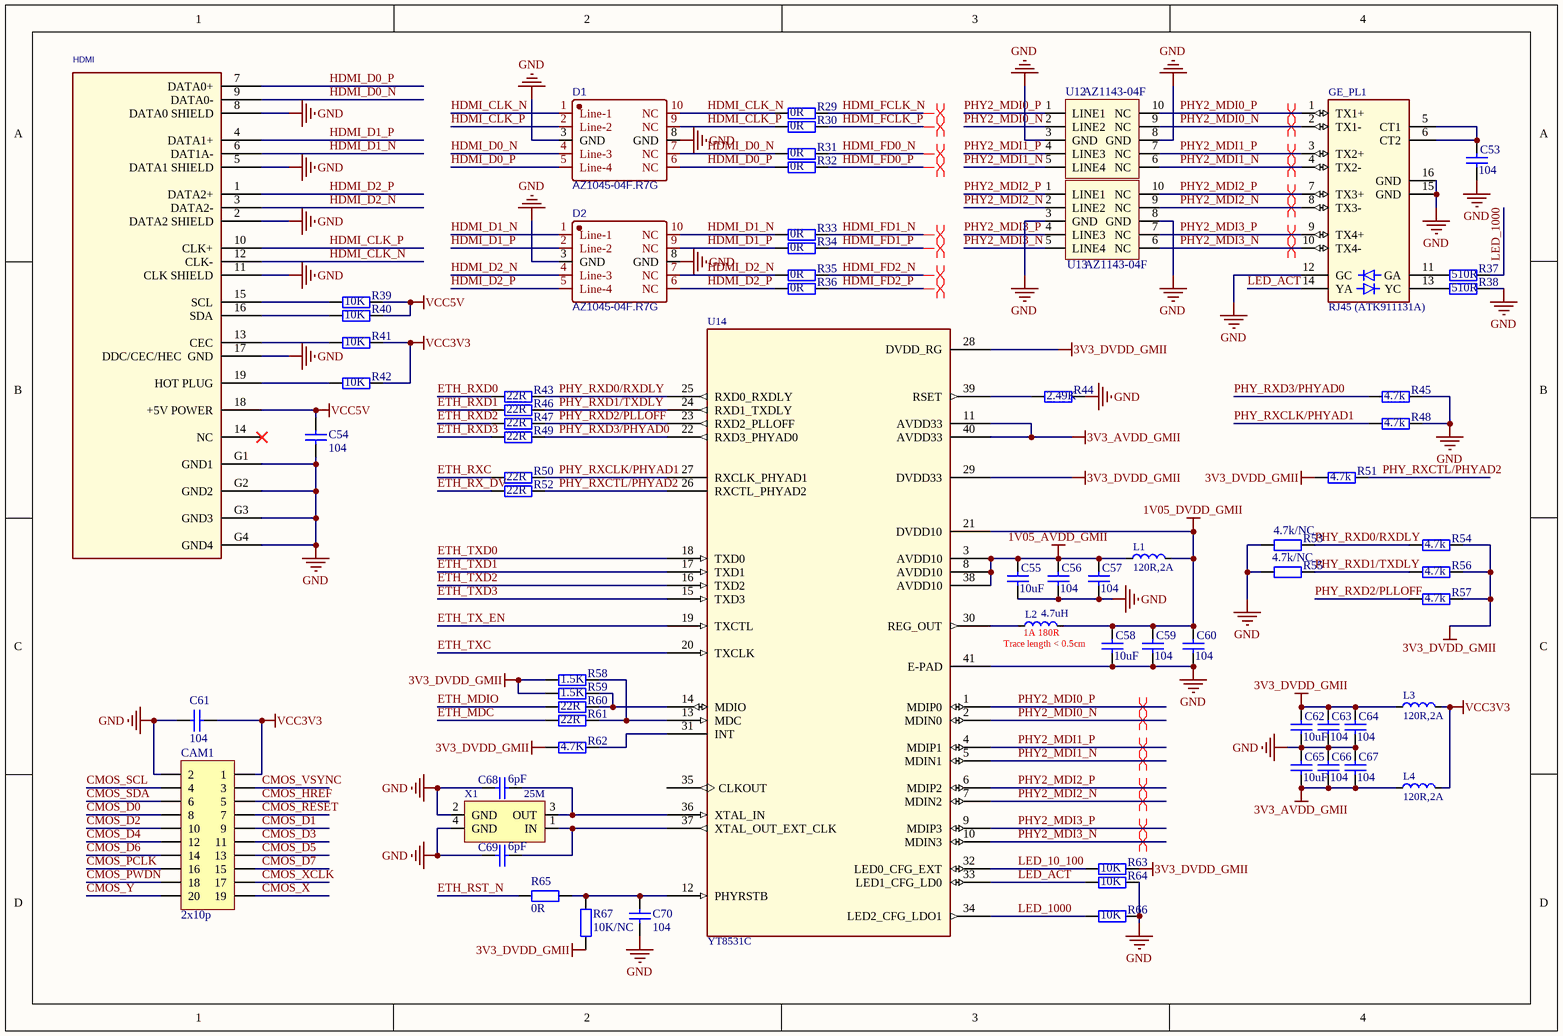
[diagram p3: 4_HDMI+ETH.SchDoc]

### Parts
C53  104  [C 0603]
C54  104  [C 0603]
C55  10uF  [C 0603]
C56  104  [C 0603]
C57  104  [C 0603]
C58  10uF  [C 0603]
C59  104  [C 0603]
C60  104  [C 0603]
C61  104  [C 0603]
C62  10uF  [C 0603]
C63  104  [C 0603]
C64  104  [C 0603]
C65  10uF  [C 0603]
C66  104  [C 0603]
C67  104  [C 0603]
C68  6pF  [C 0603]
C69  6pF  [C 0603]
C70  104  [C 0603]
CAM1  2x10p  [HEAD_2X10P]
D1  AZ1045-04F.R7G  [DFN2510P10E]
D2  AZ1045-04F.R7G  [DFN2510P10E]
GE_PL1  RJ45 (ATK911131A)  [HR911131A]
HDMI  HDMI  [HDMI-A]  (value not drawn)
L1  120R,2A  [L 0603]
L2  4.7uH  [L-2520]
L3  120R,2A  [L 0603]
L4  120R,2A  [L 0603]
R29  0R  [R 0603]
R30  0R  [R 0603]
R31  0R  [R 0603]
R32  0R  [R 0603]
R33  0R  [R 0603]
R34  0R  [R 0603]
R35  0R  [R 0603]
R36  0R  [R 0603]
R37  510R  [R 0603]
R38  510R  [R 0603]
R39  10K  [R 0603]
R40  10K  [R 0603]
R41  10K  [R 0603]
R42  10K  [R 0603]
R43  22R  [R 0603]
R44  2.49K  [R 0603]
R45  4.7k  [R 0603]
R46  22R  [R 0603]
R47  22R  [R 0603]
R48  4.7k  [R 0603]
R49  22R  [R 0603]
R50  22R  [R 0603]
R51  4.7k  [R 0603]
R52  22R  [R 0603]
R53  4.7k/NC  [R 0603]
R54  4.7k  [R 0603]
R55  4.7k/NC  [R 0603]
R56  4.7k  [R 0603]
R57  4.7k  [R 0603]
R58  1.5K  [R 0603]
R59  1.5K  [R 0603]
R60  22R  [R 0603]
R61  22R  [R 0603]
R62  4.7K  [R 0603]
R63  10K  [R 0603]
R64  10K  [R 0603]
R65  0R  [R 0603]
R66  10K  [R 0603]
R67  10K/NC  [R 0603]
U12  AZ1143-04F  [DFN2510P10E]
U13  AZ1143-04F  [DFN2510P10E]
U14  YT8531C  [QFN40 5X5_N]
X1  25M  [XTAL-3225]

### Nets
1V05_AVDD_GMII: C55.1 C56.1 C57.1 L1.1 U14.3(AVDD10) U14.8(AVDD10) U14.38(AVDD10)
1V05_DVDD_GMII: C58.1 C59.1 C60.1 L1.2 L2.2 U14.21(DVDD10)
3V3_AVDD_GMII: C65.2 C66.2 C67.2 L4.1 U14.11(AVDD33) U14.40(AVDD33)
3V3_DVDD_GMII: C62.1 C63.1 C64.1 L3.1 R51.1 R54.2 R56.2 R57.2 R58.1 R59.1 R62.1 R63.2 R67.1 U14.28(DVDD_RG) U14.29(DVDD33)
GND: C53.2 C54.2 C55.2 C56.2 C57.2 C58.2 C59.2 C60.2 C61.2 C62.2 C63.2 C64.2 C65.1 C66.1 C67.1 C68.2 C69.2 C70.2 CAM1.2 D1.3(GND) D1.8(GND) D2.3(GND) D2.8(GND) GE_PL1.12(GC) GE_PL1.15(GND) GE_PL1.16(GND) HDMI.2(DATA2_SHIELD) HDMI.5(DATA1_SHIELD) HDMI.8(DATA0_SHIELD) HDMI.11(CLK_SHIELD) HDMI.17(DDC/CEC/HEC__GND) HDMI.G1(GND1) HDMI.G2(GND2) HDMI.G3(GND3) HDMI.G4(GND4) R38.2 R44.2 R45.2 R48.2 R53.1 R55.1 R64.2 R66.2 U12.3(GND) U12.8(GND) U13.3(GND) U13.8(GND) U14.41(E-PAD) X1.2(GND) X1.4(GND)
VCC3V3: C61.1 CAM1.1 L3.2 L4.2 R41.2 R42.2
VCC5V: C54.1 HDMI.18(+5V_POWER) R39.2 R40.2
CMOS_D0: CAM1.8
CMOS_D1: CAM1.9
CMOS_D2: CAM1.10
CMOS_D3: CAM1.11
CMOS_D4: CAM1.12
CMOS_D5: CAM1.13
CMOS_D6: CAM1.14
CMOS_D7: CAM1.15
CMOS_HREF: CAM1.5
CMOS_PCLK: CAM1.16
CMOS_PWDN: CAM1.18
CMOS_RESET: CAM1.7
CMOS_SCL: CAM1.4
CMOS_SDA: CAM1.6
CMOS_VSYNC: CAM1.3
CMOS_X: CAM1.19
CMOS_XCLK: CAM1.17
CMOS_Y: CAM1.20
ETH_MDC: R61.1
ETH_MDIO: R60.1
ETH_RST_N: R65.2
ETH_RX_DV: R52.1
ETH_RXC: R50.1
ETH_RXD0: R43.1
ETH_RXD1: R46.1
ETH_RXD2: R47.1
ETH_RXD3: R49.1
ETH_TX_EN: U14.19(TXCTL)
ETH_TXC: U14.20(TXCLK)
ETH_TXD0: U14.18(TXD0)
ETH_TXD1: U14.17(TXD1)
ETH_TXD2: U14.16(TXD2)
ETH_TXD3: U14.15(TXD3)
HDMI_CLK_N: D1.1(Line-1) D1.10(NC) HDMI.12(CLK-) R29.1
HDMI_CLK_P: D1.2(Line-2) D1.9(NC) HDMI.10(CLK+) R30.1
HDMI_D0_N: D1.4(Line-3) D1.7(NC) HDMI.9(DATA0-) R31.1
HDMI_D0_P: D1.5(Line-4) D1.6(NC) HDMI.7(DATA0+) R32.1
HDMI_D1_N: D2.1(Line-1) D2.10(NC) HDMI.6(DAT1A-) R33.1
HDMI_D1_P: D2.2(Line-2) D2.9(NC) HDMI.4(DATA1+) R34.1
HDMI_D2_N: D2.4(Line-3) D2.7(NC) HDMI.3(DATA2-) R35.1
HDMI_D2_P: D2.5(Line-4) D2.6(NC) HDMI.1(DATA2+) R36.1
HDMI_FCLK_N: R29.2
HDMI_FCLK_P: R30.2
HDMI_FD0_N: R31.2
HDMI_FD0_P: R32.2
HDMI_FD1_N: R33.2
HDMI_FD1_P: R34.2
HDMI_FD2_N: R35.2
HDMI_FD2_P: R36.2
LED_10_100: R63.1 U14.32(LED0_CFG_EXT)
LED_1000: R37.2 R66.1 U14.34(LED2_CFG_LDO1)
LED_ACT: GE_PL1.14(YA) R64.1 U14.33(LED1_CFG_LD0)
PHY2_MDI0_N: GE_PL1.2(TX1-) U12.2(LINE2) U12.9(NC) U14.2(MDIN0)
PHY2_MDI0_P: GE_PL1.1(TX1+) U12.1(LINE1) U12.10(NC) U14.1(MDIP0)
PHY2_MDI1_N: GE_PL1.4(TX2-) U12.5(LINE4) U12.6(NC) U14.5(MDIN1)
PHY2_MDI1_P: GE_PL1.3(TX2+) U12.4(LINE3) U12.7(NC) U14.4(MDIP1)
PHY2_MDI2_N: GE_PL1.8(TX3-) U13.2(LINE2) U13.9(NC) U14.7(MDIN2)
PHY2_MDI2_P: GE_PL1.7(TX3+) U13.1(LINE1) U13.10(NC) U14.6(MDIP2)
PHY2_MDI3_N: GE_PL1.10(TX4-) U13.5(LINE4) U13.6(NC) U14.10(MDIN3)
PHY2_MDI3_P: GE_PL1.9(TX4+) U13.4(LINE3) U13.7(NC) U14.9(MDIP3)
PHY_RXCLK/PHYAD1: R48.1 R50.2 U14.27(RXCLK_PHYAD1)
PHY_RXCTL/PHYAD2: R51.2 R52.2 U14.26(RXCTL_PHYAD2)
PHY_RXD0/RXDLY: R43.2 R53.2 R54.1 U14.25(RXD0_RXDLY)
PHY_RXD1/TXDLY: R46.2 R55.2 R56.1 U14.24(RXD1_TXDLY)
PHY_RXD2/PLLOFF: R47.2 R57.1 U14.23(RXD2_PLLOFF)
PHY_RXD3/PHYAD0: R45.1 R49.2 U14.22(RXD3_PHYAD0)
NetC53_1: C53.1 GE_PL1.5(CT1) GE_PL1.6(CT2)
NetC68_1: C68.1 U14.36(XTAL_IN) X1.3(OUT)
NetC69_1: C69.1 U14.37(XTAL_OUT_EXT_CLK) X1.1(IN)
NetC70_1: C70.1 R65.1 R67.2 U14.12(PHYRSTB)
NetGE_PL1_11: GE_PL1.11(GA) R37.1
NetGE_PL1_13: GE_PL1.13(YC) R38.1
NetHDMI_13: HDMI.13(CEC) R41.1
NetHDMI_15: HDMI.15(SCL) R39.1
NetHDMI_16: HDMI.16(SDA) R40.1
NetHDMI_19: HDMI.19(HOT_PLUG) R42.1
NetL2_1: L2.1 U14.30(REG_OUT)
NetR44_1: R44.1 U14.39(RSET)
NetR58_2: R58.2 R61.2 U14.13(MDC)
NetR59_2: R59.2 R60.2 U14.14(MDIO)
NetR62_2: R62.2 U14.31(INT)

Not connected (* = marked no-connect by the designer): HDMI 14(NC)*; U14 35(CLKOUT)

### Layout directives
differential pair: HDMI_FCLK_N, HDMI_FCLK_P, HDMI_FD0_N, HDMI_FD0_P, HDMI_FD1_N, HDMI_FD1_P, HDMI_FD2_N, HDMI_FD2_P, PHY2_MDI0_N, PHY2_MDI0_P, PHY2_MDI1_N, PHY2_MDI1_P, PHY2_MDI2_N, PHY2_MDI2_P, PHY2_MDI3_N, PHY2_MDI3_P

### Notes on the sheet
- Trace length < 0.5cm
- (near L2) 1A 180R

### Library data of the parts
C53-C70 = C-0603-SMD
D1 D2 = AZ1045-04F.R7G: BOM_Manufacturer: AMAZING; Contributor: LCSC; BOM_Supplier: LCSC; BOM_Supplier Part: C356811; BOM_Manufacturer Part: AZ1045-04F.R7G; spicePre: D; spiceSymbolName: AZ1045-04F.R7G
GE_PL1 = HR911131A/C: 千兆以太网接口
HDMI = HDMI_A
L1-L4 = L: 小功率贴片电感磁珠
R29-R67 = R: 电阻; BOM名称: 贴片电阻; 版权归属: 正点原子; 学习资源: www.openedv.com; Parameter: 电阻
U12 U13 = AZ1143-04F: ESD保护二极管阵列
U14 = RTL8211F-CG
X1 = XTAL-4P: 4脚无源晶振

## Nets that join several sheets
GND: 1_BTB (J2.2 J3.2 J3.4 J3.6), 2_FPGAIO (66 pins), 3_SDRAM (72 pins), 4_HDMI+ETH (50 pins)
VCC1V2: 2_FPGAIO (15 pins), 3_SDRAM (C48.1 C49.1 U10.2 U10.4)
VCC2V5: 2_FPGAIO (8 pins), 3_SDRAM (C44.1 C45.1 U8.2 U8.4)
VCC3V3: 1_BTB (J2.1 J3.3 J3.5), 2_FPGAIO (45 pins), 3_SDRAM (44 pins), 4_HDMI+ETH (6 pins)
VCC5V: 1_BTB (J3.1), 3_SDRAM (13 pins), 4_HDMI+ETH (C54.1 HDMI.18 R39.2 R40.2)
B1_E5: 1_BTB (J3.17), 2_FPGAIO (U1.E5)
B2_K5: 1_BTB (J2.3), 2_FPGAIO (U1.K5)
B2_K6: 1_BTB (J2.35), 2_FPGAIO (U1.K6)
B2_L6: 1_BTB (J2.37), 2_FPGAIO (U1.L6)
B3_K8: 1_BTB (J3.30), 2_FPGAIO (U1.K8)
B3_L7: 1_BTB (J2.40), 2_FPGAIO (U1.L7)
B3_L8: 1_BTB (J3.39), 2_FPGAIO (U1.L8)
B3_M6: 1_BTB (J2.36), 2_FPGAIO (U1.M6)
B3_M7: 1_BTB (J2.38), 2_FPGAIO (U1.M7)
B3_M8: 1_BTB (J2.39), 2_FPGAIO (U1.M8)
B3_N5: 1_BTB (J2.4), 2_FPGAIO (U1.N5)
B3_N6: 1_BTB (J2.5), 2_FPGAIO (U1.N6)
B3_N8: 1_BTB (J2.33), 2_FPGAIO (U1.N8)
B3_P6: 1_BTB (J2.6), 2_FPGAIO (U1.P6)
B3_P8: 1_BTB (J2.34), 2_FPGAIO (U1.P8)
B3_R4: 1_BTB (J2.7), 2_FPGAIO (U1.R4)
B3_R5: 1_BTB (J2.9), 2_FPGAIO (U1.R5)
B3_R6: 1_BTB (J2.11), 2_FPGAIO (U1.R6)
B3_R7: 1_BTB (J2.13), 2_FPGAIO (U1.R7)
B3_R8: 1_BTB (J2.15), 2_FPGAIO (U1.R8)
B3_T4: 1_BTB (J2.8), 2_FPGAIO (U1.T4)
B3_T5: 1_BTB (J2.10), 2_FPGAIO (U1.T5)
B3_T6: 1_BTB (J2.12), 2_FPGAIO (U1.T6)
B3_T7: 1_BTB (J2.14), 2_FPGAIO (U1.T7)
B3_T8: 1_BTB (J2.16), 2_FPGAIO (U1.T8)
B4_K9: 1_BTB (J3.31), 2_FPGAIO (U1.K9)
B4_L9: 1_BTB (J3.40), 2_FPGAIO (U1.L9)
B4_L10: 1_BTB (J3.32), 2_FPGAIO (U1.L10)
B4_M9: 1_BTB (J3.38), 2_FPGAIO (U1.M9)
B4_M10: 1_BTB (J3.35), 2_FPGAIO (U1.M10)
B4_M11: 1_BTB (J3.34), 2_FPGAIO (U1.M11)
B4_N9: 1_BTB (J3.36), 2_FPGAIO (U1.N9)
B4_N12: 1_BTB (J3.33), 2_FPGAIO (U1.N12)
B4_P9: 1_BTB (J3.37), 2_FPGAIO (U1.P9)
B4_R9: 1_BTB (J2.17), 2_FPGAIO (U1.R9)
B4_R10: 1_BTB (J2.19), 2_FPGAIO (U1.R10)
B4_R11: 1_BTB (J2.21), 2_FPGAIO (U1.R11)
B4_R12: 1_BTB (J2.23), 2_FPGAIO (U1.R12)
B4_R13: 1_BTB (J2.25), 2_FPGAIO (U1.R13)
B4_R14: 1_BTB (J2.27), 2_FPGAIO (U1.R14)
B4_T9: 1_BTB (J2.18), 2_FPGAIO (U1.T9)
B4_T10: 1_BTB (J2.20), 2_FPGAIO (U1.T10)
B4_T11: 1_BTB (J2.22), 2_FPGAIO (U1.T11)
B4_T12: 1_BTB (J2.24), 2_FPGAIO (U1.T12)
B4_T13: 1_BTB (J2.26), 2_FPGAIO (U1.T13)
B4_T14: 1_BTB (J2.28), 2_FPGAIO (U1.T14)
B4_T15: 1_BTB (J2.30), 2_FPGAIO (U1.T15)
B5_P15: 1_BTB (J2.31), 2_FPGAIO (U1.P15)
B5_P16: 1_BTB (J2.32), 2_FPGAIO (U1.P16)
B5_R16: 1_BTB (J2.29), 2_FPGAIO (U1.R16)
B7_A13: 1_BTB (J3.29), 2_FPGAIO (U1.A13)
B7_B13: 1_BTB (J3.28), 2_FPGAIO (U1.B13)
B7_C9: 1_BTB (J3.14), 2_FPGAIO (U1.C9)
B7_E9: 1_BTB (J3.13), 2_FPGAIO (U1.E9)
B7_E10: 1_BTB (J3.27), 2_FPGAIO (U1.E10)
B7_F9: 1_BTB (J3.21), 2_FPGAIO (U1.F9)
B7_F10: 1_BTB (J3.22), 2_FPGAIO (U1.F10)
B8_C6: 1_BTB (J3.7), 2_FPGAIO (U1.C6)
B8_C8: 1_BTB (J3.10), 2_FPGAIO (U1.C8)
B8_D8: 1_BTB (J3.11), 2_FPGAIO (U1.D8)
B8_E6: 1_BTB (J3.8), 2_FPGAIO (U1.E6)
B8_E7: 1_BTB (J3.9), 2_FPGAIO (U1.E7)
B8_E8: 1_BTB (J3.12), 2_FPGAIO (U1.E8)
B8_F6: 1_BTB (J3.18), 2_FPGAIO (U1.F6)
B8_F7: 1_BTB (J3.19), 2_FPGAIO (U1.F7)
B8_F8: 1_BTB (J3.20), 2_FPGAIO (U1.F8)
CAN_RX: 2_FPGAIO (U1.N15), 3_SDRAM (U5.4)
CAN_TX: 2_FPGAIO (U1.N16), 3_SDRAM (U5.1)
CH340_RX: 2_FPGAIO (U1.F5), 3_SDRAM (U9.9)
CH340_TX: 2_FPGAIO (U1.G5), 3_SDRAM (U9.8)
CMOS_D0: 2_FPGAIO (U1.L4), 4_HDMI+ETH (CAM1.8)
CMOS_D1: 2_FPGAIO (U1.P3), 4_HDMI+ETH (CAM1.9)
CMOS_D2: 2_FPGAIO (U1.N3), 4_HDMI+ETH (CAM1.10)
CMOS_D3: 2_FPGAIO (U1.N1), 4_HDMI+ETH (CAM1.11)
CMOS_D4: 2_FPGAIO (U1.N2), 4_HDMI+ETH (CAM1.12)
CMOS_D5: 2_FPGAIO (U1.R1), 4_HDMI+ETH (CAM1.13)
CMOS_D6: 2_FPGAIO (U1.P1), 4_HDMI+ETH (CAM1.14)
CMOS_D7: 2_FPGAIO (U1.J1), 4_HDMI+ETH (CAM1.15)
CMOS_HREF: 2_FPGAIO (U1.G1), 4_HDMI+ETH (CAM1.5)
CMOS_PCLK: 2_FPGAIO (U1.J2), 4_HDMI+ETH (CAM1.16)
CMOS_PWDN: 2_FPGAIO (U1.K2), 4_HDMI+ETH (CAM1.18)
CMOS_RESET: 2_FPGAIO (U1.L3), 4_HDMI+ETH (CAM1.7)
CMOS_SCL: 2_FPGAIO (U1.F2), 4_HDMI+ETH (CAM1.4)
CMOS_SDA: 2_FPGAIO (U1.G2), 4_HDMI+ETH (CAM1.6)
CMOS_VSYNC: 2_FPGAIO (U1.F1), 4_HDMI+ETH (CAM1.3)
CMOS_X: 2_FPGAIO (U1.L1), 4_HDMI+ETH (CAM1.19)
CMOS_XCLK: 2_FPGAIO (U1.K1), 4_HDMI+ETH (CAM1.17)
CMOS_Y: 2_FPGAIO (U1.L2), 4_HDMI+ETH (CAM1.20)
ETH_MDC: 2_FPGAIO (U1.B4), 4_HDMI+ETH (R61.1)
ETH_MDIO: 2_FPGAIO (U1.A4), 4_HDMI+ETH (R60.1)
ETH_RST_N: 2_FPGAIO (U1.A3), 4_HDMI+ETH (R65.2)
ETH_RX_DV: 2_FPGAIO (U1.D6), 4_HDMI+ETH (R52.1)
ETH_RXC: 2_FPGAIO (U1.E1), 4_HDMI+ETH (R50.1)
ETH_RXD0: 2_FPGAIO (U1.D5), 4_HDMI+ETH (R43.1)
ETH_RXD1: 2_FPGAIO (U1.C3), 4_HDMI+ETH (R46.1)
ETH_RXD2: 2_FPGAIO (U1.B3), 4_HDMI+ETH (R47.1)
ETH_RXD3: 2_FPGAIO (U1.A2), 4_HDMI+ETH (R49.1)
ETH_TX_EN: 2_FPGAIO (U1.B7), 4_HDMI+ETH (U14.19)
ETH_TXC: 2_FPGAIO (U1.A7), 4_HDMI+ETH (U14.20)
ETH_TXD0: 2_FPGAIO (U1.A6), 4_HDMI+ETH (U14.18)
ETH_TXD1: 2_FPGAIO (U1.B6), 4_HDMI+ETH (U14.17)
ETH_TXD2: 2_FPGAIO (U1.A5), 4_HDMI+ETH (U14.16)
ETH_TXD3: 2_FPGAIO (U1.B5), 4_HDMI+ETH (U14.15)
HDMI_FCLK_N: 2_FPGAIO (U1.A12), 4_HDMI+ETH (R29.2)
HDMI_FCLK_P: 2_FPGAIO (U1.B12), 4_HDMI+ETH (R30.2)
HDMI_FD0_N: 2_FPGAIO (U1.A11), 4_HDMI+ETH (R31.2)
HDMI_FD0_P: 2_FPGAIO (U1.B11), 4_HDMI+ETH (R32.2)
HDMI_FD1_N: 2_FPGAIO (U1.A10), 4_HDMI+ETH (R33.2)
HDMI_FD1_P: 2_FPGAIO (U1.B10), 4_HDMI+ETH (R34.2)
HDMI_FD2_N: 2_FPGAIO (U1.A9), 4_HDMI+ETH (R35.2)
HDMI_FD2_P: 2_FPGAIO (U1.B9), 4_HDMI+ETH (R36.2)
IIC_SCL: 1_BTB (J3.16), 2_FPGAIO (U1.B8), 3_SDRAM (R11.1 U4.6)
IIC_SDA: 1_BTB (J3.15), 2_FPGAIO (U1.A8), 3_SDRAM (R13.1 U4.5)
KEY0: 2_FPGAIO (U1.M15), 3_SDRAM (KEY2.2 R15.1)
KEY1: 2_FPGAIO (U1.M16), 3_SDRAM (KEY3.2 R16.1)
KEY2: 2_FPGAIO (U1.E15), 3_SDRAM (KEY4.2 R19.1)
KEY3: 2_FPGAIO (U1.E16), 3_SDRAM (KEY5.2 R20.1)
LED0: 2_FPGAIO (U1.R3), 3_SDRAM (LED1.1)
LED1: 2_FPGAIO (U1.T3), 3_SDRAM (LED2.1)
LED2: 2_FPGAIO (U1.T2), 3_SDRAM (LED3.1)
LED3: 2_FPGAIO (U1.P2), 3_SDRAM (LED4.1)
RESET: 2_FPGAIO (U1.M1), 3_SDRAM (KEY1.2 R14.1)
SDIO_CMD: 2_FPGAIO (U1.D4), 3_SDRAM (J1.3 R26.1)
SDIO_D0: 2_FPGAIO (U1.D1), 3_SDRAM (J1.7 R27.1)
SDIO_D1: 2_FPGAIO (U1.F3), 3_SDRAM (J1.8 R28.1)
SDIO_D2: 2_FPGAIO (U1.B1), 3_SDRAM (J1.1 R24.1)
SDIO_D3: 2_FPGAIO (U1.C2), 3_SDRAM (J1.2 R25.1)
SDIO_SCK: 2_FPGAIO (U1.D3), 3_SDRAM (J1.5)
SDRAM_A0: 2_FPGAIO (U1.F11), 3_SDRAM (U3.23)
SDRAM_A1: 2_FPGAIO (U1.E11), 3_SDRAM (U3.24)
SDRAM_A2: 2_FPGAIO (U1.D14), 3_SDRAM (U3.25)
SDRAM_A3: 2_FPGAIO (U1.C14), 3_SDRAM (U3.26)
SDRAM_A4: 2_FPGAIO (U1.A14), 3_SDRAM (U3.29)
SDRAM_A5: 2_FPGAIO (U1.A15), 3_SDRAM (U3.30)
SDRAM_A6: 2_FPGAIO (U1.B16), 3_SDRAM (U3.31)
SDRAM_A7: 2_FPGAIO (U1.C15), 3_SDRAM (U3.32)
SDRAM_A8: 2_FPGAIO (U1.C16), 3_SDRAM (U3.33)
SDRAM_A9: 2_FPGAIO (U1.D15), 3_SDRAM (U3.34)
SDRAM_A10: 2_FPGAIO (U1.F14), 3_SDRAM (U3.22)
SDRAM_A11: 2_FPGAIO (U1.D16), 3_SDRAM (U3.35)
SDRAM_A12: 2_FPGAIO (U1.F15), 3_SDRAM (U3.36)
SDRAM_BA0: 2_FPGAIO (U1.G11), 3_SDRAM (U3.20)
SDRAM_BA1: 2_FPGAIO (U1.F13), 3_SDRAM (U3.21)
SDRAM_CAS: 2_FPGAIO (U1.J12), 3_SDRAM (U3.17)
SDRAM_CKE: 2_FPGAIO (U1.F16), 3_SDRAM (U3.37)
SDRAM_CLK: 2_FPGAIO (U1.B14), 3_SDRAM (U3.38)
SDRAM_CS: 2_FPGAIO (U1.K10), 3_SDRAM (U3.19)
SDRAM_D0: 2_FPGAIO (U1.P14), 3_SDRAM (U3.2)
SDRAM_D1: 2_FPGAIO (U1.M12), 3_SDRAM (U3.4)
SDRAM_D2: 2_FPGAIO (U1.N14), 3_SDRAM (U3.5)
SDRAM_D3: 2_FPGAIO (U1.L12), 3_SDRAM (U3.7)
SDRAM_D4: 2_FPGAIO (U1.L13), 3_SDRAM (U3.8)
SDRAM_D5: 2_FPGAIO (U1.L14), 3_SDRAM (U3.10)
SDRAM_D6: 2_FPGAIO (U1.L11), 3_SDRAM (U3.11)
SDRAM_D7: 2_FPGAIO (U1.K12), 3_SDRAM (U3.13)
SDRAM_D8: 2_FPGAIO (U1.G16), 3_SDRAM (U3.42)
SDRAM_D9: 2_FPGAIO (U1.J11), 3_SDRAM (U3.44)
SDRAM_D10: 2_FPGAIO (U1.J16), 3_SDRAM (U3.45)
SDRAM_D11: 2_FPGAIO (U1.J15), 3_SDRAM (U3.47)
SDRAM_D12: 2_FPGAIO (U1.K16), 3_SDRAM (U3.48)
SDRAM_D13: 2_FPGAIO (U1.K15), 3_SDRAM (U3.50)
SDRAM_D14: 2_FPGAIO (U1.L16), 3_SDRAM (U3.51)
SDRAM_D15: 2_FPGAIO (U1.L15), 3_SDRAM (U3.53)
SDRAM_DQM0: 2_FPGAIO (U1.J14), 3_SDRAM (U3.15)
SDRAM_DQM1: 2_FPGAIO (U1.G15), 3_SDRAM (U3.39)
SDRAM_RAS: 2_FPGAIO (U1.K11), 3_SDRAM (U3.18)
SDRAM_WE: 2_FPGAIO (U1.J13), 3_SDRAM (U3.16)
W25Q64_CLK: 1_BTB (J3.23), 2_FPGAIO (U1.D9), 3_SDRAM (U7.6)
W25Q64_CS: 1_BTB (J3.25), 2_FPGAIO (U1.D12), 3_SDRAM (U7.1)
W25Q64_DI: 1_BTB (J3.24), 2_FPGAIO (U1.D11), 3_SDRAM (U7.5)
W25Q64_DO: 1_BTB (J3.26), 2_FPGAIO (U1.C11), 3_SDRAM (U7.2)